# EAGLE design Arduino_Clock_Dividerx4_board1_reduced_thickness (EAGLE 9.1.2)
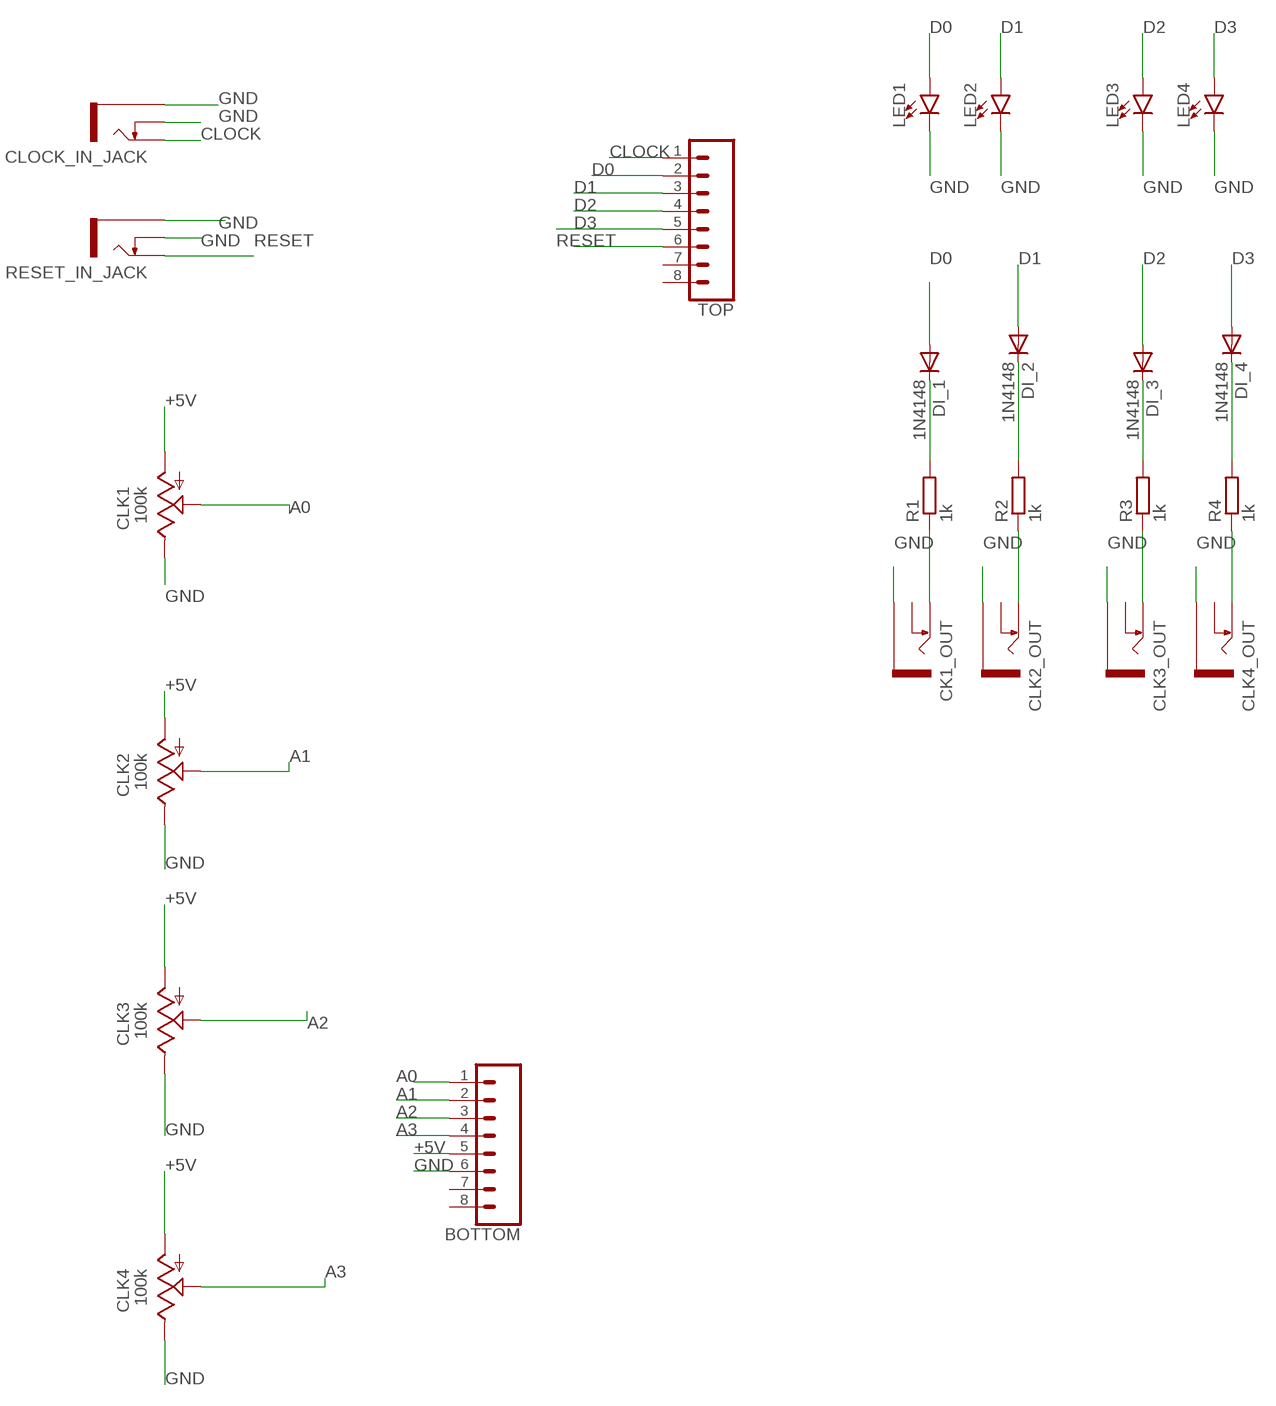
[diagram p0: schematic, sheet 1]

## Parts
BOTTOM  CONN_08LONGPADS  [1X08_LONGPADS]
CK1_OUT  THONKICONNNEW  [WQP-PJ301M-12_JACK]
CLK1  100k  9MM_SNAP-IN_POT_  [9MM_SNAP-IN_POT]
CLK2  100k  9MM_SNAP-IN_POT_  [9MM_SNAP-IN_POT]
CLK2_OUT  THONKICONNNEW  [WQP-PJ301M-12_JACK]
CLK3  100k  9MM_SNAP-IN_POT_  [9MM_SNAP-IN_POT]
CLK3_OUT  THONKICONNNEW  [WQP-PJ301M-12_JACK]
CLK4  100k  9MM_SNAP-IN_POT_  [9MM_SNAP-IN_POT]
CLK4_OUT  THONKICONNNEW  [WQP-PJ301M-12_JACK]
CLOCK_IN_JACK  THONKICONNNEW  [WQP-PJ301M-12_JACK]
DI_1  1N4148  SMALL_DIODEDO35-7  [DO35-7]
DI_2  1N4148  SMALL_DIODEDO35-7  [DO35-7]
DI_3  1N4148  SMALL_DIODEDO35-7  [DO35-7]
DI_4  1N4148  SMALL_DIODEDO35-7  [DO35-7]
LED1  LED3MM  [LED_3MM]
LED2  LED3MM  [LED_3MM]
LED3  LED3MM  [LED_3MM]
LED4  LED3MM  [LED_3MM]
R1  1k  RESISTOR7MM  [7MM_RESISTOR]
R2  1k  RESISTOR7MM  [7MM_RESISTOR]
R3  1k  RESISTOR7MM  [7MM_RESISTOR]
R4  1k  RESISTOR7MM  [7MM_RESISTOR]
RESET_IN_JACK  THONKICONNNEW  [WQP-PJ301M-12_JACK]
TOP  CONN_08LONGPADS  [1X08_LONGPADS]

## Nets
+5V: BOTTOM.5 CLK1.1(A) CLK2.1(A) CLK3.1(A) CLK4.1(A)
A0: BOTTOM.1 CLK1.2(S)
A1: BOTTOM.2 CLK2.2(S)
A2: BOTTOM.3 CLK3.2(S)
A3: BOTTOM.4 CLK4.2(S)
CLOCK: CLOCK_IN_JACK.P$1_TIP(TIP) TOP.1
D0: DI_1.A LED1.A TOP.2
D1: DI_2.A LED2.A TOP.3
D2: DI_3.A LED3.A TOP.4
D3: DI_4.A LED4.A TOP.5
DI2: DI_2.C R2.2
GND: BOTTOM.6 CK1_OUT.P$3_SLEEVE(SLEEVE) CLK1.3(E) CLK2.3(E) CLK2_OUT.P$3_SLEEVE(SLEEVE) CLK3.3(E) CLK3_OUT.P$3_SLEEVE(SLEEVE) CLK4.3(E) CLK4_OUT.P$3_SLEEVE(SLEEVE) CLOCK_IN_JACK.P$2_SWITCH(SWITCH) CLOCK_IN_JACK.P$3_SLEEVE(SLEEVE) LED1.K(C) LED2.K(C) LED3.K(C) LED4.K(C) RESET_IN_JACK.P$2_SWITCH(SWITCH) RESET_IN_JACK.P$3_SLEEVE(SLEEVE)
N$1: CLK3_OUT.P$1_TIP(TIP) R3.1
N$3: CLK4_OUT.P$1_TIP(TIP) R4.1
N$4: DI_1.C R1.2
N$6: DI_3.C R3.2
N$7: DI_4.C R4.2
N$17: CLK2_OUT.P$1_TIP(TIP) R2.1
N$18: CK1_OUT.P$1_TIP(TIP) R1.1
RESET: RESET_IN_JACK.P$1_TIP(TIP) TOP.6
Unconnected: BOTTOM.7 BOTTOM.8 CK1_OUT.P$2_SWITCH(SWITCH) CLK2_OUT.P$2_SWITCH(SWITCH) CLK3_OUT.P$2_SWITCH(SWITCH) CLK4_OUT.P$2_SWITCH(SWITCH) TOP.7 TOP.8

## Library data of the parts
BOTTOM TOP = SparkFun-Connectors:CONN_08: Multi connection point. Often used as Generic Header-pin footprint for 0.1 inch spaced/style header connections On any of the 0.1 inch spaced packages, you can populate with these: Break Away Headers - Straight <https://www.sparkfun.com/products/116> (PRT-00116) Break Away Male Headers - Right Angle <https://www.sparkfun.com/products/553> (PRT-00553) Female Headers <https://www.sparkfun.com/products/115> (PRT-00115) Break Away Headers - Machine Pin <https://www.sparkfun.com/products/117> (PRT-00117) Break Away Female Headers - Swiss Machine Pin <https://www.sparkfun.com/products/743> (PRT-00743) Arduino Stackable Header - 8 Pin <https://www.sparkfun.com/products/9279> (PRT-09279) For SCREWTERMINALS and SPRING TERMINALS visit here: Screw Terimnals on SparkFun.com <https://www.sparkfun.com/search/results?term=Screw+Terminals> (5mm/3.5mm/2.54mm spacing) This device is also useful as a general connection point to wire up your design to another part of your project. Our various solder wires solder well into these plated through hole pads. Hook-Up Wire - Assortment (Stranded, 22 AWG) <https://www.sparkfun.com/products/11375> (PRT-11375) Hook-Up Wire - Assortment (Solid Core, 22 AWG) <https://www.sparkfun.com/products/11367> (PRT-11367) View the entire wire category on our website here <https://www.sparkfun.com/categories/141> Special notes: Molex polarized connector foot print use with SKU : PRT-08231 with associated crimp pins and housings. 1MM SMD Version SKU: PRT-10208 NOTES ON THE VARIANTS LOCK and LOCK_LONGPADS... This footprint was designed to help hold the alignment of a through-hole component (i.e. 6-pin header) while soldering it into place. You may notice that each hole has been shifted either up or down by 0.005 of an inch from it's more standard position (which is a perfectly straight line). This slight alteration caused the pins (the squares in the middle) to touch the edges of the holes. Because they are alternating, it causes a "brace" to hold the component in place. 0.005 has proven to be the perfect amount of "off-center" position when using our standard breakaway headers. Although looks a little odd when you look at the bare footprint, once you have a header in there, the alteration is very hard to notice. Also,if you push a header all the way into place, it is covered up entirely on the bottom side.
CK1_OUT CLK2_OUT CLK3_OUT CLK4_OUT CLOCK_IN_JACK RESET_IN_JACK = MusicThingModular:THONKICONN: 3.5mm socket for Eurorack modular synths
CLK1-CLK4 = MusicThingModular:9MM_SNAP-IN_POT: 9mm vertical snap-in pot, Alpha / Panasonic style
DI_1-DI_4 = MusicThingModular:SMALL_DIODE: Small Signal Diode
LED1-LED4 = SparkFun-LED:LED: LED (Generic) Standard schematic elements and footprints for 5mm, 3mm, 1206, and 0603 sized LEDs. Generic LEDs with no color specified.; PROD_ID: DIO-08794; SPICEPREFIX: L
R1-R4 = MusicThingModular:RESISTOR: Standard resistor, various versions

## Board
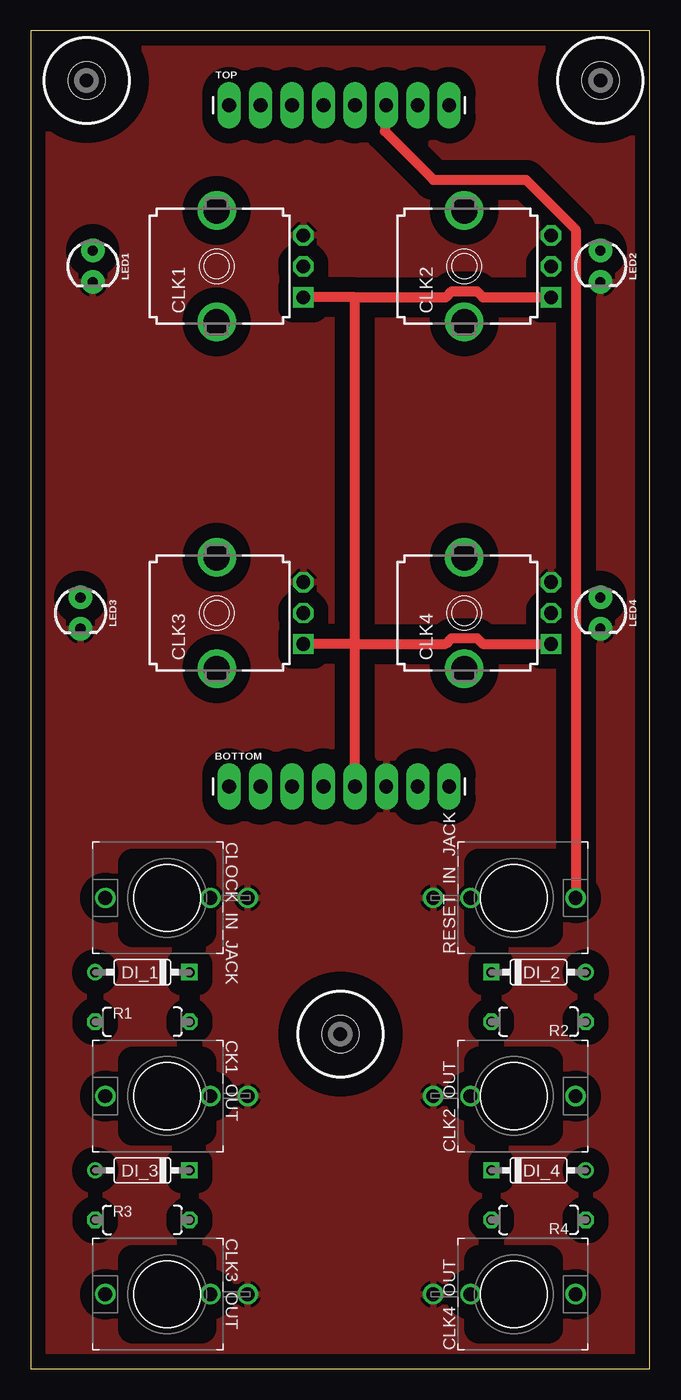
[diagram p1: board, top side]
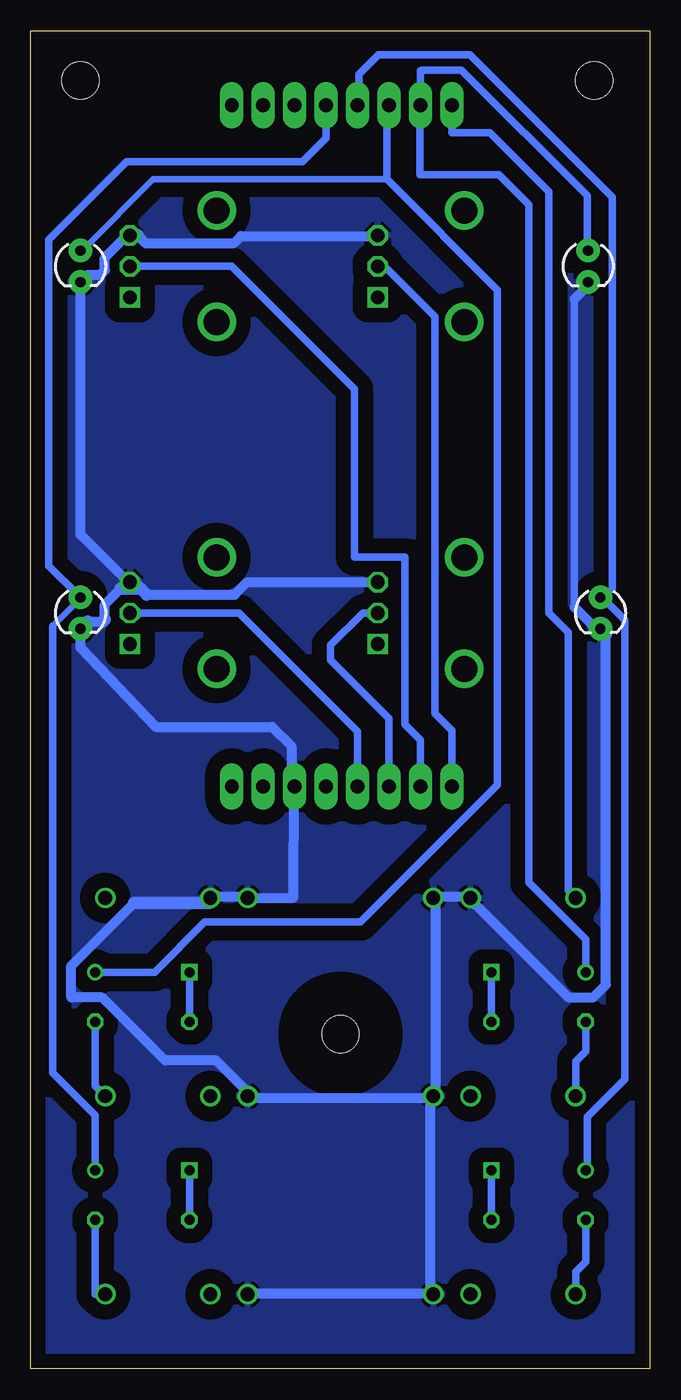
[diagram p2: board, bottom side, seen from below]

Size 50 x 108 mm. Coordinates in mm from the lower left corner, seen from the top.
Outline: 0,0 50,0 50,108 0,108 0,0
Copper layers (1*16): Top 0.035mm / dielectric 1.5mm / Bottom 0.035mm
Design rules "default *": minimum track width 20mil, minimum drill 24mil, track to track 20mil, track to pad 20mil, pad to pad 20mil, via to via 20mil, smd to smd 8mil, copper to edge 40mil, drill to drill 6mil, minimum pad ring 10mil, minimum via ring 8mil, stop-mask expansion 4mil, vias tented up to drill 0mil, thermal gap 10mil

### Footprints (pad centres in the part's own frame; a part is rotated, then mirrored left to right if it is on the bottom)
1X08_LONGPADS = drill 1.118 pad 1.88 long: 1 0,0; 2 2.54,0; 3 5.08,0; 4 7.62,0; 5 10.16,0; 6 12.7,0; 7 15.24,0; 8 17.78,0
WQP-PJ301M-12_JACK = drill 1.1: P$1_TIP 0,5; P$2_SWITCH 0,-3.5; P$3_SLEEVE 0,-6.5
9MM_SNAP-IN_POT = drill 1.1 square: 1 -2.5,-7 | drill 1.1 octagon: 2 0,-7; 3 2.5,-7 | drill 2.1 pad 2.794: CHASSIS1 -4.5,0; CHASSIS2 4.5,0
DO35-7 = drill 0.813: A 3.81,0 | drill 0.813 square: C -3.81,0
DRIL-3 = hole 3: 0,0
LED_3MM = drill 0.813 pad 1.88: A -1.27,0; K 1.27,0
7MM_RESISTOR = drill 0.813 octagon: 1 -3.81,0; 2 3.81,0

### Placement (x,y rotation side)
BOTTOM  16,47 0 top
CK1_OUT  11,22 90 top
CLK1  15,89 90 top
CLK2  35,89 90 top
CLK2_OUT  39,22 270 top
CLK3  15,61 90 top
CLK3_OUT  11,6 90 top
CLK4  35,61 90 top
CLK4_OUT  39,6 270 top
CLOCK_IN_JACK  11,38 90 top
DI_1  9,32 180 top
DI_2  41,32 0 top
DI_3  9,16 180 top
DI_4  41,16 0 top
H1  [DRIL-3]  4.5,104 0 top
H2  [DRIL-3]  46,104 0 top
H3  [DRIL-3]  25,27 0 top
LED1  5,89 270 top
LED2  46,89 270 top
LED3  4,61 270 top
LED4  46,61 270 top
R1  9,28 0 top
R2  41,28 180 top
R3  9,12 0 top
R4  41,12 180 top
RESET_IN_JACK  39,38 270 top
TOP  16,102 0 top

### Tracks (layer width: path | path; a pad name or v marks a point on that pad's centre or on a via)
+5V
  Top 0.813: BOTTOM.5 26.16,58 26.16,58.5 | 26.16,58.5 26.16,86.5 | 26.16,86.5 CLK1.1 | 26.16,86.5 33.5,86.5 33.98,86.97 36.02,86.97 36.5,86.5 CLK2.1 | 26.16,58.5 CLK3.1 | CLK4.1 41.5,58.5 36.5,58.5 36.02,58.97 33.98,58.97 33.5,58.5 26.16,58.5
A0
  Bottom 0.61: BOTTOM.1 16,51.5 17.38,52.88 17.38,84.94 21.44,89 CLK1.2
A1
  Bottom 0.61: 20.74,65.53 21,65.53 | 21,65.53 23.88,65.53 23.88,79.08 33.8,89 CLK2.2 | BOTTOM.2 18.54,50.74 | 18.54,50.74 18.6,50.8 | 18.54,50.74 19.8,52 19.8,65.53 21,65.53
A2
  Bottom 0.61: BOTTOM.3 21.08,52.48 25.8,57.2 25.8,58.4 23.2,61 CLK3.2
A3
  Bottom 0.61: BOTTOM.4 23.62,51.42 33.2,61 CLK4.2
CLOCK
  Bottom 0.61: TOP.1 16,99.8 12.95,99.8 8.16,95.01 8.16,61.01 6.6,59.44 6.6,38.62 6,38.02 CLOCK_IN_JACK.P$1_TIP
D0
  Bottom 0.508: 5.08,90.42 LED1.A
  Bottom 0.61: 5.08,90.42 5.08,94.69 15.24,104.85 18.46,104.85 18.54,104.77 TOP.2 18.6,101.94 18.6,96.4 12.2,96.4 9.78,93.98 9.78,39.24 5.19,34.65 DI_1.A
D1
  Bottom 0.508: 44.7,32 DI_2.A | 21.23,96.01 40.13,96.01 45.72,90.42 LED2.A
  Bottom 0.61: 44.7,32 40.02,32 35.96,36.07 23.37,36.07 12.31,47.13 12.31,87.09 21.23,96.01 21.23,101.85 TOP.3
D2
  Bottom 0.508: 5.08,16.26 DI_3.A | 3.05,62.99 3.56,62.48 LED3.A | 23.5,102.12 TOP.4
  Bottom 0.61: 5.08,16.26 5.08,20.32 2.03,23.37 2.03,60.45 3.56,61.98 LED3.A | 23.5,102.12 23.5,104.5 21.94,106.06 14.53,106.06 3.05,94.58 3.05,62.99
D3
  Bottom 0.508: 48.25,59.95 46.23,61.98 LED4.A 46.23,62.48 | 44.81,17.13
  Bottom 0.61: 48.25,59.95 48.25,23.87 44.81,20.43 44.81,17.13 DI_4.A | 46.23,62.48 48.55,64.81 48.55,91.13 42.26,97.43 28.07,97.43 26.16,99.34 TOP.5
DI2
  Bottom 0.61: R2.2 DI_2.C
GND
  Bottom 0.508: 32.51,38.1 RESET_IN_JACK.P$3_SLEEVE | CLK4.3 42.16,63.5 | 28.96,47.24 28.75,47.05 BOTTOM.6 | 4.57,59.94 4.06,59.94 LED3.K | 14.73,38.1 CLOCK_IN_JACK.P$2_SWITCH | 17.27,38.1 CLOCK_IN_JACK.P$3_SLEEVE 17.27,37.59 | 17.78,21.84 CK1_OUT.P$3_SLEEVE 17.27,22.35 | 32,21.84 CLK2_OUT.P$3_SLEEVE | 17.78,6.1 CLK3_OUT.P$3_SLEEVE | 35.56,37.59 RESET_IN_JACK.P$2_SWITCH
  Bottom 0.61: 6.1,86.36 6.1,61.47
  Bottom 0.813: 22.35,91.44 33.03,91.44 33.64,90.83 40.73,90.83 41.4,91.5 | 35.05,38.1 32.51,38.1 | 22.35,63.5 32.53,63.5 33.54,62.49 40.65,62.49 | 28.96,47.24 28.96,50.26 30.51,51.82 39.94,51.82 46,58.18 LED4.K | 6.1,61.47 4.57,59.94 | 5.08,87.38 6.1,86.36 | 32,6.1 17.78,6.1 17.78,21.84 32,21.84 | 17.27,38.1 14.73,38.1 | 17.27,22.35 17.27,37.59 | 3.56,59.29 3.56,31 4.57,29.98 6.61,29.98 14.22,37.59 | 41.66,37.59 46.74,32.51 46.74,29.96 44.25,29.96 39.16,24.88 35.04,24.88 32.51,22.35 | 45.42,60.31 44.19,60.31 | 44.04,60.46 44.04,61.69 42.74,62.99 | 42.16,63.5 46,67.34 LED2.K 45.42,88.31 44.39,88.31 44.04,88.66 44.04,89.69 42.23,91.5 | RESET_IN_JACK.P$3_SLEEVE 28.8,38 28.75,47.05
  Bottom 1.016: 22.35,91.44 CLK1.3 | 35.05,38.1 RESET_IN_JACK.P$2_SWITCH | 28.8,46.9 BOTTOM.6 | 41.15,62.99 41.66,63.5 CLK4.3 | 22.35,63.5 CLK3.3 | 5.08,87.38 LED1.K | 17.78,6.1 CLK3_OUT.P$3_SLEEVE | 32,6.1 CLK4_OUT.P$3_SLEEVE | 17.78,21.84 CK1_OUT.P$3_SLEEVE | 14.22,37.59 CLOCK_IN_JACK.P$2_SWITCH | 41.66,37.59 35.56,37.59 | 32.51,22.35 CLK2_OUT.P$3_SLEEVE | 45.72,59.94 45.79,59.94 LED4.K 45.42,60.31 | 42.74,62.99 41.15,62.99 | 44.19,60.31 44.04,60.46 | 41.15,62.99 40.65,62.49 | 3.56,59.29 LED3.K | 41.4,91.5 CLK2.3 | CLK2.3 42.2,91.5 | 42.23,91.5 CLK2.3
  pour Top (isolate 1.2): 0.2,0 0.2,107.8 49.8,107.8 50,108 50,0.2 49.8,0
  pour Bottom (isolate 1.2): 0,0 0,107.6 0.6,108.2 49.6,108.2 50,107.8 50,0
N$1
  Bottom 0.61: CLK3_OUT.P$1_TIP 6,7.8 5.19,8.61 R3.1
N$3
  Bottom 0.61: R4.1 44.8,6 CLK4_OUT.P$1_TIP
N$4
  Bottom 0.61: R1.2 DI_1.C
N$6
  Bottom 0.61: R3.2 DI_3.C
N$7
  Bottom 0.61: DI_4.C R4.2
N$17
  Bottom 0.61: CLK2_OUT.P$1_TIP 44.81,22.81 R2.1
N$18
  Bottom 0.61: CK1_OUT.P$1_TIP 6,24.8 5.19,25.61 R1.1
RESET
  Top 0.813: RESET_IN_JACK.P$1_TIP 44,91.96 39.99,95.97 32.51,95.97 28.59,99.89 28.59,101.89 TOP.6